# Altium project RDA8280-Module.PrjPcb
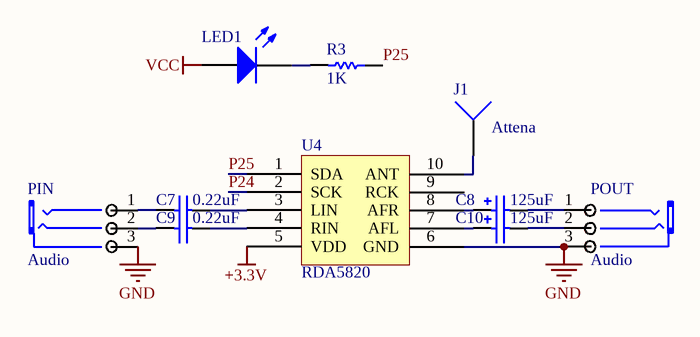
[diagram p0: RDA5280-Module.SchDoc]
1 sheet, 10 parts. Net scope: global (net labels, ports and power ports of the same name join across sheets).
Board file: RDA5280-Module.PcbDoc

## Sheet RDA5280-Module.SchDoc
size A4; PageSetup: Record=PageOptions|CenterHorizontal=True|CenterVertical=True|PrintScale=0.97|XCorrection=1.00|YCorrection=1.00|PrintKind=0|BorderSize=5000000|LeftOffset=0|BottomOffset=0|Orientation=2|PaperLength=1000|PaperWidth=1000|Scale=100|PaperSource=7|PrintQuality=-4|MediaType=1|DitherType=10|PaperKind=A4|PrintScaleMode=1

### Parts
C7  value 0.22uF  [C104]  (hidden comment: Cap)
C8  value 125uF  [C+100，R-160]  (hidden comment: Cap Pol2)
C9  value 0.22uF  [C104]  (hidden comment: Cap)
C10  value 125uF  [C+100，R-160]  (hidden comment: Cap Pol2)
J1  Attena  [PIN1]
LED1  LED2_red  [C+100，R-160]  (value not drawn)
PIN  Audio  [PHONE_ST]
POUT  Audio  [PHONE_ST]
R3  value 1K  [AXIAL-0.3]  (hidden comment: Res1)
U4  RDA5820  [RDA5820]

### Nets
+3.3V: U4.5(VDD)
GND: PIN.3(COM) POUT.3(COM) U4.6(GND)
VCC: LED1.1(A)
P24: U4.2(SCK)
P25: R3.1 U4.1(SDA)
NetC7_1: C7.1 U4.3(LIN)
NetC7_2: C7.2 PIN.1(CHL)
NetC8_1: C8.1 U4.8(AFR)
NetC8_2: C8.2 POUT.1(CHL)
NetC9_1: C9.1 U4.4(RIN)
NetC9_2: C9.2 PIN.2(CHR)
NetC10_1: C10.1 U4.7(AFL)
NetC10_2: C10.2 POUT.2(CHR)
NetJ1_1: J1.1 U4.10(ANT)
NetLED1_2: LED1.2(K) R3.2

Not connected (* = marked no-connect by the designer): U4 9(RCK)

### Library data of the parts
C7 C9 = Cap: Capacitor; Published: 8-Jun-2000; LatestRevisionDate: 17-Jul-2002; LatestRevisionNote: Re-released for DXP Platform.; PackageReference: RAD-0.3; Publisher: Altium Limited
C8 C10 = Cap Pol2: Polarized Capacitor (Axial); Published: 8-Jun-2000; LatestRevisionDate: 17-Jul-2002; LatestRevisionNote: Re-released for DXP Platform.; PackageReference: POLAR0.8; Publisher: Altium Limited
J1 = Socket: LatestRevisionDate: 17-Jul-2002; LatestRevisionNote: Re-released for DXP Platform.; Publisher: Altium Limited
LED1 = LED2: Typical RED, GREEN, YELLOW, AMBER GaAs LED; Published: 8-Jun-2000; LatestRevisionDate: 17-Jul-2002; LatestRevisionNote: Re-released for DXP Platform.; PackageDocument: Feb-2002; PackageReference: 3.2X1.6X1.1; Publisher: Altium Limited
PIN POUT = PHONE_M
R3 = Res1: Resistor; Published: 8-Jun-2000; LatestRevisionDate: 17-Jul-2002; LatestRevisionNote: Re-released for DXP Platform.; PackageReference: AXIAL-0.3; Publisher: Altium Limited